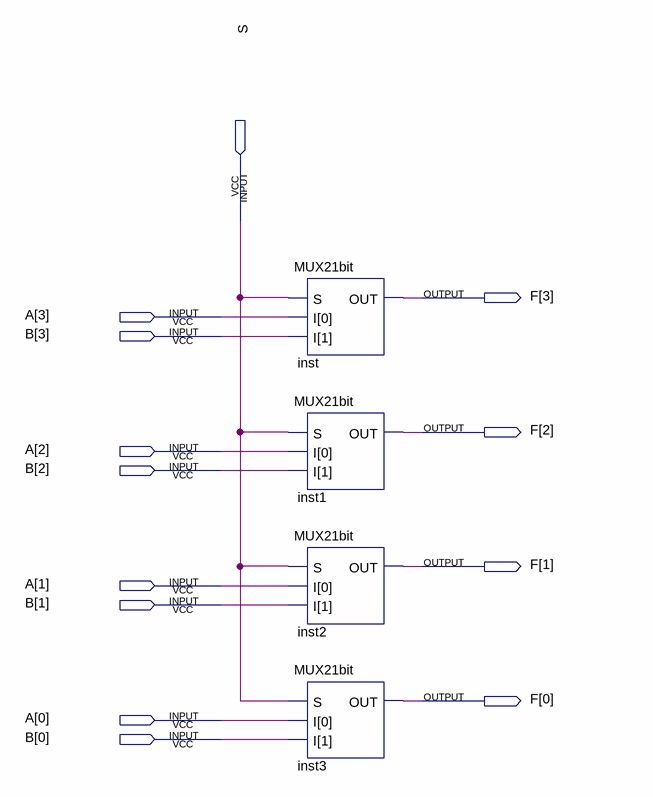
[diagram p0: schematic sheet]
// Quartus schematic mux24bit.bdf as structural Verilog: 4 symbols, 13 pins
module mux24bit (
  input  S,
  input  [3:0] A,
  input  [3:0] B,
  output [3:0] F
);

  MUX21bit inst (.S(S), .I({B[3], A[3]}), .OUT(F[3]));
  MUX21bit inst1 (.S(S), .I({B[2], A[2]}), .OUT(F[2]));
  MUX21bit inst2 (.S(S), .I({B[1], A[1]}), .OUT(F[1]));
  MUX21bit inst3 (.S(S), .I({B[0], A[0]}), .OUT(F[0]));
endmodule
